# EAGLE schematic WS2812-Ring_v10 (EAGLE 6.6.0)
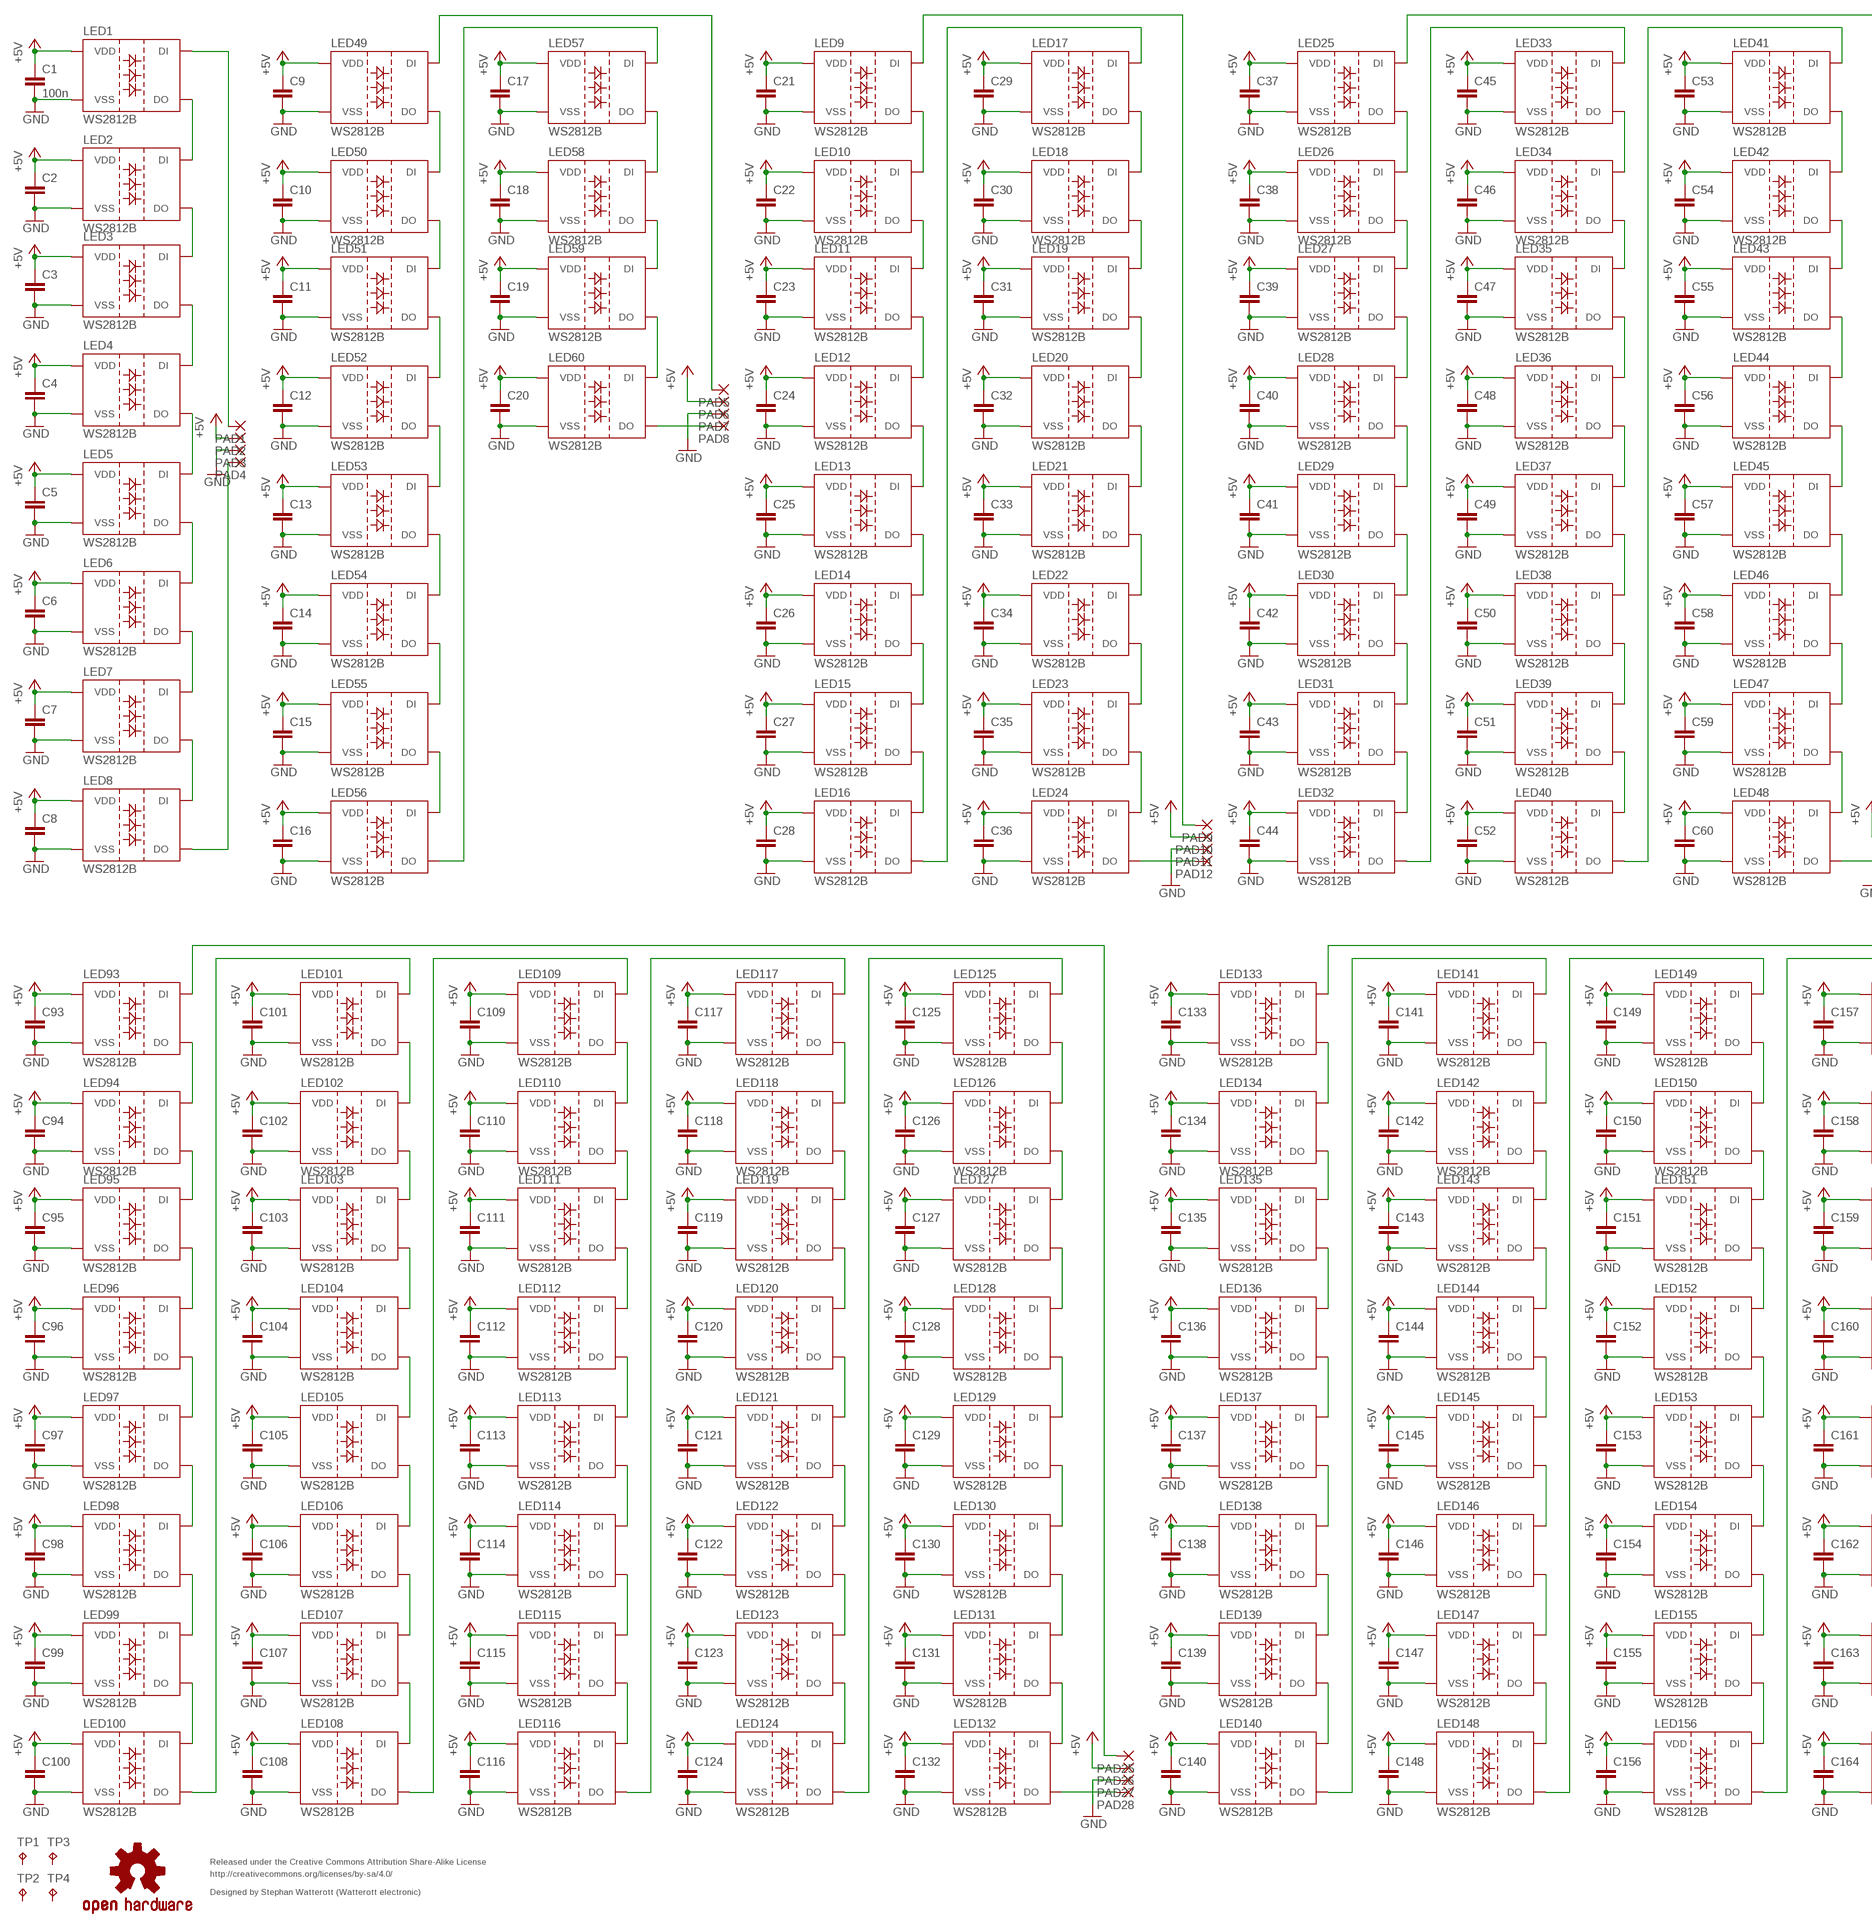
[diagram p0: schematic, sheet 1, part 1 of 2]
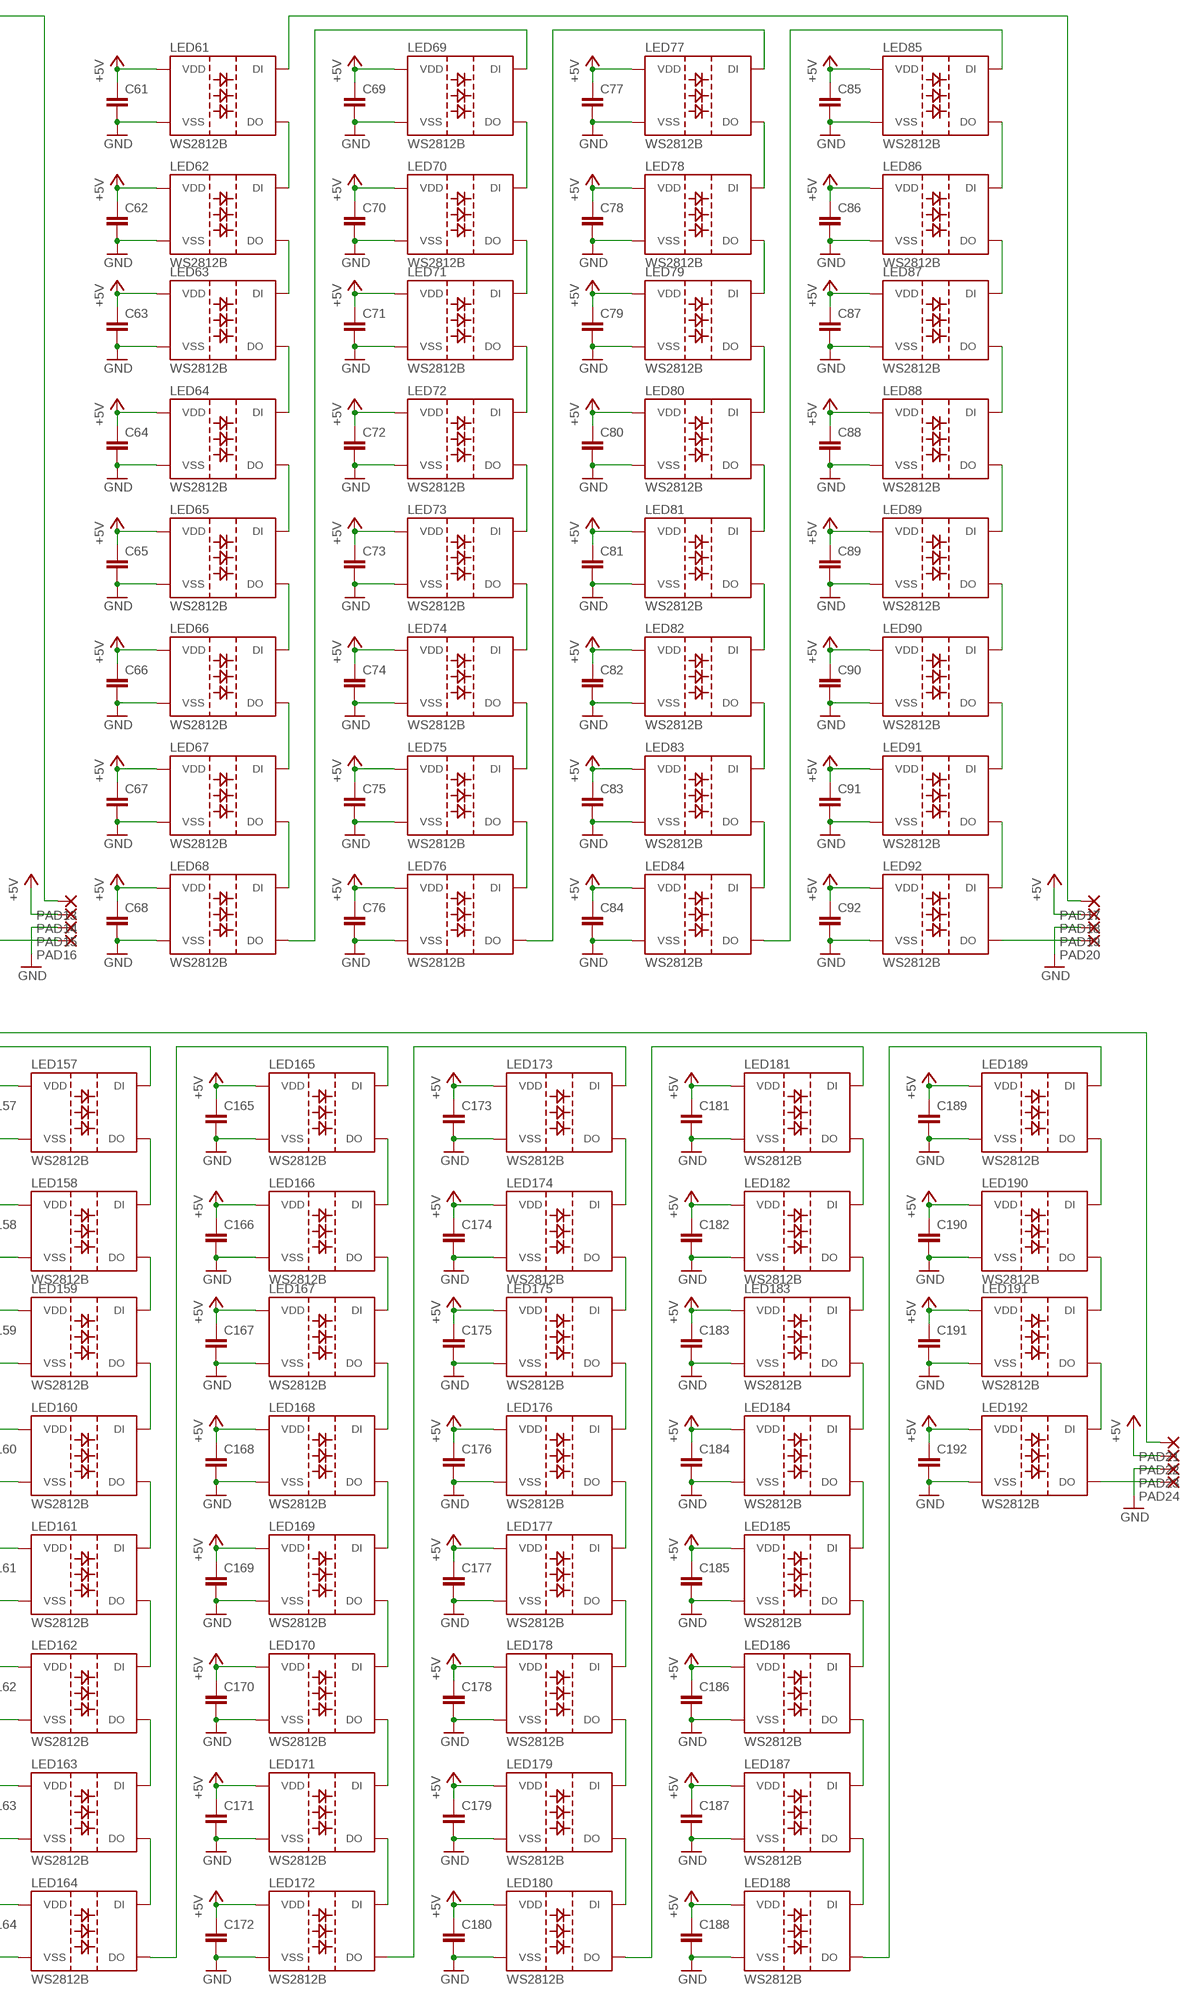
[diagram p1: schematic, sheet 1, part 2 of 2]

## Parts
C1  100n  C-EUC0402K  [C0402K]
C2  C-EUC0402K  [C0402K]
C3  C-EUC0402K  [C0402K]
C4  C-EUC0402K  [C0402K]
C5  C-EUC0402K  [C0402K]
C6  C-EUC0402K  [C0402K]
C7  C-EUC0402K  [C0402K]
C8  C-EUC0402K  [C0402K]
C9  C-EUC0402K  [C0402K]
C10  C-EUC0402K  [C0402K]
C11  C-EUC0402K  [C0402K]
C12  C-EUC0402K  [C0402K]
C13  C-EUC0402K  [C0402K]
C14  C-EUC0402K  [C0402K]
C15  C-EUC0402K  [C0402K]
C16  C-EUC0402K  [C0402K]
C17  C-EUC0402K  [C0402K]
C18  C-EUC0402K  [C0402K]
C19  C-EUC0402K  [C0402K]
C20  C-EUC0402K  [C0402K]
C21  C-EUC0402K  [C0402K]
C22  C-EUC0402K  [C0402K]
C23  C-EUC0402K  [C0402K]
C24  C-EUC0402K  [C0402K]
C25  C-EUC0402K  [C0402K]
C26  C-EUC0402K  [C0402K]
C27  C-EUC0402K  [C0402K]
C28  C-EUC0402K  [C0402K]
C29  C-EUC0402K  [C0402K]
C30  C-EUC0402K  [C0402K]
C31  C-EUC0402K  [C0402K]
C32  C-EUC0402K  [C0402K]
C33  C-EUC0402K  [C0402K]
C34  C-EUC0402K  [C0402K]
C35  C-EUC0402K  [C0402K]
C36  C-EUC0402K  [C0402K]
C37  C-EUC0402K  [C0402K]
C38  C-EUC0402K  [C0402K]
C39  C-EUC0402K  [C0402K]
C40  C-EUC0402K  [C0402K]
C41  C-EUC0402K  [C0402K]
C42  C-EUC0402K  [C0402K]
C43  C-EUC0402K  [C0402K]
C44  C-EUC0402K  [C0402K]
C45  C-EUC0402K  [C0402K]
C46  C-EUC0402K  [C0402K]
C47  C-EUC0402K  [C0402K]
C48  C-EUC0402K  [C0402K]
C49  C-EUC0402K  [C0402K]
C50  C-EUC0402K  [C0402K]
C51  C-EUC0402K  [C0402K]
C52  C-EUC0402K  [C0402K]
C53  C-EUC0402K  [C0402K]
C54  C-EUC0402K  [C0402K]
C55  C-EUC0402K  [C0402K]
C56  C-EUC0402K  [C0402K]
C57  C-EUC0402K  [C0402K]
C58  C-EUC0402K  [C0402K]
C59  C-EUC0402K  [C0402K]
C60  C-EUC0402K  [C0402K]
C61  C-EUC0402K  [C0402K]
C62  C-EUC0402K  [C0402K]
C63  C-EUC0402K  [C0402K]
C64  C-EUC0402K  [C0402K]
C65  C-EUC0402K  [C0402K]
C66  C-EUC0402K  [C0402K]
C67  C-EUC0402K  [C0402K]
C68  C-EUC0402K  [C0402K]
C69  C-EUC0402K  [C0402K]
C70  C-EUC0402K  [C0402K]
C71  C-EUC0402K  [C0402K]
C72  C-EUC0402K  [C0402K]
C73  C-EUC0402K  [C0402K]
C74  C-EUC0402K  [C0402K]
C75  C-EUC0402K  [C0402K]
C76  C-EUC0402K  [C0402K]
C77  C-EUC0402K  [C0402K]
C78  C-EUC0402K  [C0402K]
C79  C-EUC0402K  [C0402K]
C80  C-EUC0402K  [C0402K]
C81  C-EUC0402K  [C0402K]
C82  C-EUC0402K  [C0402K]
C83  C-EUC0402K  [C0402K]
C84  C-EUC0402K  [C0402K]
C85  C-EUC0402K  [C0402K]
C86  C-EUC0402K  [C0402K]
C87  C-EUC0402K  [C0402K]
C88  C-EUC0402K  [C0402K]
C89  C-EUC0402K  [C0402K]
C90  C-EUC0402K  [C0402K]
C91  C-EUC0402K  [C0402K]
C92  C-EUC0402K  [C0402K]
C93  C-EUC0402K  [C0402K]
C94  C-EUC0402K  [C0402K]
C95  C-EUC0402K  [C0402K]
C96  C-EUC0402K  [C0402K]
C97  C-EUC0402K  [C0402K]
C98  C-EUC0402K  [C0402K]
C99  C-EUC0402K  [C0402K]
C100  C-EUC0402K  [C0402K]
C101  C-EUC0402K  [C0402K]
C102  C-EUC0402K  [C0402K]
C103  C-EUC0402K  [C0402K]
C104  C-EUC0402K  [C0402K]
C105  C-EUC0402K  [C0402K]
C106  C-EUC0402K  [C0402K]
C107  C-EUC0402K  [C0402K]
C108  C-EUC0402K  [C0402K]
C109  C-EUC0402K  [C0402K]
C110  C-EUC0402K  [C0402K]
C111  C-EUC0402K  [C0402K]
C112  C-EUC0402K  [C0402K]
C113  C-EUC0402K  [C0402K]
C114  C-EUC0402K  [C0402K]
C115  C-EUC0402K  [C0402K]
C116  C-EUC0402K  [C0402K]
C117  C-EUC0402K  [C0402K]
C118  C-EUC0402K  [C0402K]
C119  C-EUC0402K  [C0402K]
C120  C-EUC0402K  [C0402K]
C121  C-EUC0402K  [C0402K]
C122  C-EUC0402K  [C0402K]
C123  C-EUC0402K  [C0402K]
C124  C-EUC0402K  [C0402K]
C125  C-EUC0402K  [C0402K]
C126  C-EUC0402K  [C0402K]
C127  C-EUC0402K  [C0402K]
C128  C-EUC0402K  [C0402K]
C129  C-EUC0402K  [C0402K]
C130  C-EUC0402K  [C0402K]
C131  C-EUC0402K  [C0402K]
C132  C-EUC0402K  [C0402K]
C133  C-EUC0402K  [C0402K]
C134  C-EUC0402K  [C0402K]
C135  C-EUC0402K  [C0402K]
C136  C-EUC0402K  [C0402K]
C137  C-EUC0402K  [C0402K]
C138  C-EUC0402K  [C0402K]
C139  C-EUC0402K  [C0402K]
C140  C-EUC0402K  [C0402K]
C141  C-EUC0402K  [C0402K]
C142  C-EUC0402K  [C0402K]
C143  C-EUC0402K  [C0402K]
C144  C-EUC0402K  [C0402K]
C145  C-EUC0402K  [C0402K]
C146  C-EUC0402K  [C0402K]
C147  C-EUC0402K  [C0402K]
C148  C-EUC0402K  [C0402K]
C149  C-EUC0402K  [C0402K]
C150  C-EUC0402K  [C0402K]
C151  C-EUC0402K  [C0402K]
C152  C-EUC0402K  [C0402K]
C153  C-EUC0402K  [C0402K]
C154  C-EUC0402K  [C0402K]
C155  C-EUC0402K  [C0402K]
C156  C-EUC0402K  [C0402K]
C157  C-EUC0402K  [C0402K]
C158  C-EUC0402K  [C0402K]
C159  C-EUC0402K  [C0402K]
C160  C-EUC0402K  [C0402K]
C161  C-EUC0402K  [C0402K]
C162  C-EUC0402K  [C0402K]
C163  C-EUC0402K  [C0402K]
C164  C-EUC0402K  [C0402K]
C165  C-EUC0402K  [C0402K]
C166  C-EUC0402K  [C0402K]
C167  C-EUC0402K  [C0402K]
C168  C-EUC0402K  [C0402K]
C169  C-EUC0402K  [C0402K]
C170  C-EUC0402K  [C0402K]
C171  C-EUC0402K  [C0402K]
C172  C-EUC0402K  [C0402K]
C173  C-EUC0402K  [C0402K]
C174  C-EUC0402K  [C0402K]
C175  C-EUC0402K  [C0402K]
C176  C-EUC0402K  [C0402K]
C177  C-EUC0402K  [C0402K]
C178  C-EUC0402K  [C0402K]
C179  C-EUC0402K  [C0402K]
C180  C-EUC0402K  [C0402K]
C181  C-EUC0402K  [C0402K]
C182  C-EUC0402K  [C0402K]
C183  C-EUC0402K  [C0402K]
C184  C-EUC0402K  [C0402K]
C185  C-EUC0402K  [C0402K]
C186  C-EUC0402K  [C0402K]
C187  C-EUC0402K  [C0402K]
C188  C-EUC0402K  [C0402K]
C189  C-EUC0402K  [C0402K]
C190  C-EUC0402K  [C0402K]
C191  C-EUC0402K  [C0402K]
C192  C-EUC0402K  [C0402K]
LED1  WS2812B  [WS2812B]
LED2  WS2812B  [WS2812B]
LED3  WS2812B  [WS2812B]
LED4  WS2812B  [WS2812B]
LED5  WS2812B  [WS2812B]
LED6  WS2812B  [WS2812B]
LED7  WS2812B  [WS2812B]
LED8  WS2812B  [WS2812B]
LED9  WS2812B  [WS2812B]
LED10  WS2812B  [WS2812B]
LED11  WS2812B  [WS2812B]
LED12  WS2812B  [WS2812B]
LED13  WS2812B  [WS2812B]
LED14  WS2812B  [WS2812B]
LED15  WS2812B  [WS2812B]
LED16  WS2812B  [WS2812B]
LED17  WS2812B  [WS2812B]
LED18  WS2812B  [WS2812B]
LED19  WS2812B  [WS2812B]
LED20  WS2812B  [WS2812B]
LED21  WS2812B  [WS2812B]
LED22  WS2812B  [WS2812B]
LED23  WS2812B  [WS2812B]
LED24  WS2812B  [WS2812B]
LED25  WS2812B  [WS2812B]
LED26  WS2812B  [WS2812B]
LED27  WS2812B  [WS2812B]
LED28  WS2812B  [WS2812B]
LED29  WS2812B  [WS2812B]
LED30  WS2812B  [WS2812B]
LED31  WS2812B  [WS2812B]
LED32  WS2812B  [WS2812B]
LED33  WS2812B  [WS2812B]
LED34  WS2812B  [WS2812B]
LED35  WS2812B  [WS2812B]
LED36  WS2812B  [WS2812B]
LED37  WS2812B  [WS2812B]
LED38  WS2812B  [WS2812B]
LED39  WS2812B  [WS2812B]
LED40  WS2812B  [WS2812B]
LED41  WS2812B  [WS2812B]
LED42  WS2812B  [WS2812B]
LED43  WS2812B  [WS2812B]
LED44  WS2812B  [WS2812B]
LED45  WS2812B  [WS2812B]
LED46  WS2812B  [WS2812B]
LED47  WS2812B  [WS2812B]
LED48  WS2812B  [WS2812B]
LED49  WS2812B  [WS2812B]
LED50  WS2812B  [WS2812B]
LED51  WS2812B  [WS2812B]
LED52  WS2812B  [WS2812B]
LED53  WS2812B  [WS2812B]
LED54  WS2812B  [WS2812B]
LED55  WS2812B  [WS2812B]
LED56  WS2812B  [WS2812B]
LED57  WS2812B  [WS2812B]
LED58  WS2812B  [WS2812B]
LED59  WS2812B  [WS2812B]
LED60  WS2812B  [WS2812B]
LED61  WS2812B  [WS2812B]
LED62  WS2812B  [WS2812B]
LED63  WS2812B  [WS2812B]
LED64  WS2812B  [WS2812B]
LED65  WS2812B  [WS2812B]
LED66  WS2812B  [WS2812B]
LED67  WS2812B  [WS2812B]
LED68  WS2812B  [WS2812B]
LED69  WS2812B  [WS2812B]
LED70  WS2812B  [WS2812B]
LED71  WS2812B  [WS2812B]
LED72  WS2812B  [WS2812B]
LED73  WS2812B  [WS2812B]
LED74  WS2812B  [WS2812B]
LED75  WS2812B  [WS2812B]
LED76  WS2812B  [WS2812B]
LED77  WS2812B  [WS2812B]
LED78  WS2812B  [WS2812B]
LED79  WS2812B  [WS2812B]
LED80  WS2812B  [WS2812B]
LED81  WS2812B  [WS2812B]
LED82  WS2812B  [WS2812B]
LED83  WS2812B  [WS2812B]
LED84  WS2812B  [WS2812B]
LED85  WS2812B  [WS2812B]
LED86  WS2812B  [WS2812B]
LED87  WS2812B  [WS2812B]
LED88  WS2812B  [WS2812B]
LED89  WS2812B  [WS2812B]
LED90  WS2812B  [WS2812B]
LED91  WS2812B  [WS2812B]
LED92  WS2812B  [WS2812B]
LED93  WS2812B  [WS2812B]
LED94  WS2812B  [WS2812B]
LED95  WS2812B  [WS2812B]
LED96  WS2812B  [WS2812B]
LED97  WS2812B  [WS2812B]
LED98  WS2812B  [WS2812B]
LED99  WS2812B  [WS2812B]
LED100  WS2812B  [WS2812B]
LED101  WS2812B  [WS2812B]
LED102  WS2812B  [WS2812B]
LED103  WS2812B  [WS2812B]
LED104  WS2812B  [WS2812B]
LED105  WS2812B  [WS2812B]
LED106  WS2812B  [WS2812B]
LED107  WS2812B  [WS2812B]
LED108  WS2812B  [WS2812B]
LED109  WS2812B  [WS2812B]
LED110  WS2812B  [WS2812B]
LED111  WS2812B  [WS2812B]
LED112  WS2812B  [WS2812B]
LED113  WS2812B  [WS2812B]
LED114  WS2812B  [WS2812B]
LED115  WS2812B  [WS2812B]
LED116  WS2812B  [WS2812B]
LED117  WS2812B  [WS2812B]
LED118  WS2812B  [WS2812B]
LED119  WS2812B  [WS2812B]
LED120  WS2812B  [WS2812B]
LED121  WS2812B  [WS2812B]
LED122  WS2812B  [WS2812B]
LED123  WS2812B  [WS2812B]
LED124  WS2812B  [WS2812B]
LED125  WS2812B  [WS2812B]
LED126  WS2812B  [WS2812B]
LED127  WS2812B  [WS2812B]
LED128  WS2812B  [WS2812B]
LED129  WS2812B  [WS2812B]
LED130  WS2812B  [WS2812B]
LED131  WS2812B  [WS2812B]
LED132  WS2812B  [WS2812B]
LED133  WS2812B  [WS2812B]
LED134  WS2812B  [WS2812B]
LED135  WS2812B  [WS2812B]
LED136  WS2812B  [WS2812B]
LED137  WS2812B  [WS2812B]
LED138  WS2812B  [WS2812B]
LED139  WS2812B  [WS2812B]
LED140  WS2812B  [WS2812B]
LED141  WS2812B  [WS2812B]
LED142  WS2812B  [WS2812B]
LED143  WS2812B  [WS2812B]
LED144  WS2812B  [WS2812B]
LED145  WS2812B  [WS2812B]
LED146  WS2812B  [WS2812B]
LED147  WS2812B  [WS2812B]
LED148  WS2812B  [WS2812B]
LED149  WS2812B  [WS2812B]
LED150  WS2812B  [WS2812B]
LED151  WS2812B  [WS2812B]
LED152  WS2812B  [WS2812B]
LED153  WS2812B  [WS2812B]
LED154  WS2812B  [WS2812B]
LED155  WS2812B  [WS2812B]
LED156  WS2812B  [WS2812B]
LED157  WS2812B  [WS2812B]
LED158  WS2812B  [WS2812B]
LED159  WS2812B  [WS2812B]
LED160  WS2812B  [WS2812B]
LED161  WS2812B  [WS2812B]
LED162  WS2812B  [WS2812B]
LED163  WS2812B  [WS2812B]
LED164  WS2812B  [WS2812B]
LED165  WS2812B  [WS2812B]
LED166  WS2812B  [WS2812B]
LED167  WS2812B  [WS2812B]
LED168  WS2812B  [WS2812B]
LED169  WS2812B  [WS2812B]
LED170  WS2812B  [WS2812B]
LED171  WS2812B  [WS2812B]
LED172  WS2812B  [WS2812B]
LED173  WS2812B  [WS2812B]
LED174  WS2812B  [WS2812B]
LED175  WS2812B  [WS2812B]
LED176  WS2812B  [WS2812B]
LED177  WS2812B  [WS2812B]
LED178  WS2812B  [WS2812B]
LED179  WS2812B  [WS2812B]
LED180  WS2812B  [WS2812B]
LED181  WS2812B  [WS2812B]
LED182  WS2812B  [WS2812B]
LED183  WS2812B  [WS2812B]
LED184  WS2812B  [WS2812B]
LED185  WS2812B  [WS2812B]
LED186  WS2812B  [WS2812B]
LED187  WS2812B  [WS2812B]
LED188  WS2812B  [WS2812B]
LED189  WS2812B  [WS2812B]
LED190  WS2812B  [WS2812B]
LED191  WS2812B  [WS2812B]
LED192  WS2812B  [WS2812B]
LOGO7  OSHW-LOGOM  [OSHW-LOGO-M]
PAD1  SMD2  [SMD1,27-2,54]
PAD2  SMD2  [SMD1,27-2,54]
PAD3  SMD2  [SMD1,27-2,54]
PAD4  SMD2  [SMD1,27-2,54]
PAD5  SMD2  [SMD1,27-2,54]
PAD6  SMD2  [SMD1,27-2,54]
PAD7  SMD2  [SMD1,27-2,54]
PAD8  SMD2  [SMD1,27-2,54]
PAD9  SMD2  [SMD1,27-2,54]
PAD10  SMD2  [SMD1,27-2,54]
PAD11  SMD2  [SMD1,27-2,54]
PAD12  SMD2  [SMD1,27-2,54]
PAD13  SMD2  [SMD1,27-2,54]
PAD14  SMD2  [SMD1,27-2,54]
PAD15  SMD2  [SMD1,27-2,54]
PAD16  SMD2  [SMD1,27-2,54]
PAD17  SMD2  [SMD1,27-2,54]
PAD18  SMD2  [SMD1,27-2,54]
PAD19  SMD2  [SMD1,27-2,54]
PAD20  SMD2  [SMD1,27-2,54]
PAD21  SMD2  [SMD1,27-2,54]
PAD22  SMD2  [SMD1,27-2,54]
PAD23  SMD2  [SMD1,27-2,54]
PAD24  SMD2  [SMD1,27-2,54]
PAD25  SMD2  [SMD1,27-2,54]
PAD26  SMD2  [SMD1,27-2,54]
PAD27  SMD2  [SMD1,27-2,54]
PAD28  SMD2  [SMD1,27-2,54]
TP1  TPB1,27  [B1,27]
TP2  TPB1,27  [B1,27]
TP3  TPB1,27  [B1,27]
TP4  TPB1,27  [B1,27]

## Nets
+5V: C1.1 C2.1 C3.1 C4.1 C5.1 C6.1 C7.1 C8.1 C9.1 C10.1 C11.1 C12.1 C13.1 C14.1 C15.1 C16.1 C17.1 C18.1 C19.1 C20.1 C21.1 C22.1 C23.1 C24.1 C25.1 C26.1 C27.1 C28.1 C29.1 C30.1 C31.1 C32.1 C33.1 C34.1 C35.1 C36.1 C37.1 C38.1 C39.1 C40.1 C41.1 C42.1 C43.1 C44.1 C45.1 C46.1 C47.1 C48.1 C49.1 C50.1 C51.1 C52.1 C53.1 C54.1 C55.1 C56.1 C57.1 C58.1 C59.1 C60.1 C61.1 C62.1 C63.1 C64.1 C65.1 C66.1 C67.1 C68.1 C69.1 C70.1 C71.1 C72.1 C73.1 C74.1 C75.1 C76.1 C77.1 C78.1 C79.1 C80.1 C81.1 C82.1 C83.1 C84.1 C85.1 C86.1 C87.1 C88.1 C89.1 C90.1 C91.1 C92.1 C93.1 C94.1 C95.1 C96.1 C97.1 C98.1 C99.1 C100.1 C101.1 C102.1 C103.1 C104.1 C105.1 C106.1 C107.1 C108.1 C109.1 C110.1 C111.1 C112.1 C113.1 C114.1 C115.1 C116.1 C117.1 C118.1 C119.1 C120.1 C121.1 C122.1 C123.1 C124.1 C125.1 C126.1 C127.1 C128.1 C129.1 C130.1 C131.1 C132.1 C133.1 C134.1 C135.1 C136.1 C137.1 C138.1 C139.1 C140.1 C141.1 C142.1 C143.1 C144.1 C145.1 C146.1 C147.1 C148.1 C149.1 C150.1 C151.1 C152.1 C153.1 C154.1 C155.1 C156.1 C157.1 C158.1 C159.1 C160.1 C161.1 C162.1 C163.1 C164.1 C165.1 C166.1 C167.1 C168.1 C169.1 C170.1 C171.1 C172.1 C173.1 C174.1 C175.1 C176.1 C177.1 C178.1 C179.1 C180.1 C181.1 C182.1 C183.1 C184.1 C185.1 C186.1 C187.1 C188.1 C189.1 C190.1 C191.1 C192.1 LED1.1(VDD) LED2.1(VDD) LED3.1(VDD) LED4.1(VDD) LED5.1(VDD) LED6.1(VDD) LED7.1(VDD) LED8.1(VDD) LED9.1(VDD) LED10.1(VDD) LED11.1(VDD) LED12.1(VDD) LED13.1(VDD) LED14.1(VDD) LED15.1(VDD) LED16.1(VDD) LED17.1(VDD) LED18.1(VDD) LED19.1(VDD) LED20.1(VDD) LED21.1(VDD) LED22.1(VDD) LED23.1(VDD) LED24.1(VDD) LED25.1(VDD) LED26.1(VDD) LED27.1(VDD) LED28.1(VDD) LED29.1(VDD) LED30.1(VDD) LED31.1(VDD) LED32.1(VDD) LED33.1(VDD) LED34.1(VDD) LED35.1(VDD) LED36.1(VDD) LED37.1(VDD) LED38.1(VDD) LED39.1(VDD) LED40.1(VDD) LED41.1(VDD) LED42.1(VDD) LED43.1(VDD) LED44.1(VDD) LED45.1(VDD) LED46.1(VDD) LED47.1(VDD) LED48.1(VDD) LED49.1(VDD) LED50.1(VDD) LED51.1(VDD) LED52.1(VDD) LED53.1(VDD) LED54.1(VDD) LED55.1(VDD) LED56.1(VDD) LED57.1(VDD) LED58.1(VDD) LED59.1(VDD) LED60.1(VDD) LED61.1(VDD) LED62.1(VDD) LED63.1(VDD) LED64.1(VDD) LED65.1(VDD) LED66.1(VDD) LED67.1(VDD) LED68.1(VDD) LED69.1(VDD) LED70.1(VDD) LED71.1(VDD) LED72.1(VDD) LED73.1(VDD) LED74.1(VDD) LED75.1(VDD) LED76.1(VDD) LED77.1(VDD) LED78.1(VDD) LED79.1(VDD) LED80.1(VDD) LED81.1(VDD) LED82.1(VDD) LED83.1(VDD) LED84.1(VDD) LED85.1(VDD) LED86.1(VDD) LED87.1(VDD) LED88.1(VDD) LED89.1(VDD) LED90.1(VDD) LED91.1(VDD) LED92.1(VDD) LED93.1(VDD) LED94.1(VDD) LED95.1(VDD) LED96.1(VDD) LED97.1(VDD) LED98.1(VDD) LED99.1(VDD) LED100.1(VDD) LED101.1(VDD) LED102.1(VDD) LED103.1(VDD) LED104.1(VDD) LED105.1(VDD) LED106.1(VDD) LED107.1(VDD) LED108.1(VDD) LED109.1(VDD) LED110.1(VDD) LED111.1(VDD) LED112.1(VDD) LED113.1(VDD) LED114.1(VDD) LED115.1(VDD) LED116.1(VDD) LED117.1(VDD) LED118.1(VDD) LED119.1(VDD) LED120.1(VDD) LED121.1(VDD) LED122.1(VDD) LED123.1(VDD) LED124.1(VDD) LED125.1(VDD) LED126.1(VDD) LED127.1(VDD) LED128.1(VDD) LED129.1(VDD) LED130.1(VDD) LED131.1(VDD) LED132.1(VDD) LED133.1(VDD) LED134.1(VDD) LED135.1(VDD) LED136.1(VDD) LED137.1(VDD) LED138.1(VDD) LED139.1(VDD) LED140.1(VDD) LED141.1(VDD) LED142.1(VDD) LED143.1(VDD) LED144.1(VDD) LED145.1(VDD) LED146.1(VDD) LED147.1(VDD) LED148.1(VDD) LED149.1(VDD) LED150.1(VDD) LED151.1(VDD) LED152.1(VDD) LED153.1(VDD) LED154.1(VDD) LED155.1(VDD) LED156.1(VDD) LED157.1(VDD) LED158.1(VDD) LED159.1(VDD) LED160.1(VDD) LED161.1(VDD) LED162.1(VDD) LED163.1(VDD) LED164.1(VDD) LED165.1(VDD) LED166.1(VDD) LED167.1(VDD) LED168.1(VDD) LED169.1(VDD) LED170.1(VDD) LED171.1(VDD) LED172.1(VDD) LED173.1(VDD) LED174.1(VDD) LED175.1(VDD) LED176.1(VDD) LED177.1(VDD) LED178.1(VDD) LED179.1(VDD) LED180.1(VDD) LED181.1(VDD) LED182.1(VDD) LED183.1(VDD) LED184.1(VDD) LED185.1(VDD) LED186.1(VDD) LED187.1(VDD) LED188.1(VDD) LED189.1(VDD) LED190.1(VDD) LED191.1(VDD) LED192.1(VDD) PAD2.1(P) PAD6.1(P) PAD10.1(P) PAD14.1(P) PAD18.1(P) PAD22.1(P) PAD26.1(P)
GND: C1.2 C2.2 C3.2 C4.2 C5.2 C6.2 C7.2 C8.2 C9.2 C10.2 C11.2 C12.2 C13.2 C14.2 C15.2 C16.2 C17.2 C18.2 C19.2 C20.2 C21.2 C22.2 C23.2 C24.2 C25.2 C26.2 C27.2 C28.2 C29.2 C30.2 C31.2 C32.2 C33.2 C34.2 C35.2 C36.2 C37.2 C38.2 C39.2 C40.2 C41.2 C42.2 C43.2 C44.2 C45.2 C46.2 C47.2 C48.2 C49.2 C50.2 C51.2 C52.2 C53.2 C54.2 C55.2 C56.2 C57.2 C58.2 C59.2 C60.2 C61.2 C62.2 C63.2 C64.2 C65.2 C66.2 C67.2 C68.2 C69.2 C70.2 C71.2 C72.2 C73.2 C74.2 C75.2 C76.2 C77.2 C78.2 C79.2 C80.2 C81.2 C82.2 C83.2 C84.2 C85.2 C86.2 C87.2 C88.2 C89.2 C90.2 C91.2 C92.2 C93.2 C94.2 C95.2 C96.2 C97.2 C98.2 C99.2 C100.2 C101.2 C102.2 C103.2 C104.2 C105.2 C106.2 C107.2 C108.2 C109.2 C110.2 C111.2 C112.2 C113.2 C114.2 C115.2 C116.2 C117.2 C118.2 C119.2 C120.2 C121.2 C122.2 C123.2 C124.2 C125.2 C126.2 C127.2 C128.2 C129.2 C130.2 C131.2 C132.2 C133.2 C134.2 C135.2 C136.2 C137.2 C138.2 C139.2 C140.2 C141.2 C142.2 C143.2 C144.2 C145.2 C146.2 C147.2 C148.2 C149.2 C150.2 C151.2 C152.2 C153.2 C154.2 C155.2 C156.2 C157.2 C158.2 C159.2 C160.2 C161.2 C162.2 C163.2 C164.2 C165.2 C166.2 C167.2 C168.2 C169.2 C170.2 C171.2 C172.2 C173.2 C174.2 C175.2 C176.2 C177.2 C178.2 C179.2 C180.2 C181.2 C182.2 C183.2 C184.2 C185.2 C186.2 C187.2 C188.2 C189.2 C190.2 C191.2 C192.2 LED1.3(VSS) LED2.3(VSS) LED3.3(VSS) LED4.3(VSS) LED5.3(VSS) LED6.3(VSS) LED7.3(VSS) LED8.3(VSS) LED9.3(VSS) LED10.3(VSS) LED11.3(VSS) LED12.3(VSS) LED13.3(VSS) LED14.3(VSS) LED15.3(VSS) LED16.3(VSS) LED17.3(VSS) LED18.3(VSS) LED19.3(VSS) LED20.3(VSS) LED21.3(VSS) LED22.3(VSS) LED23.3(VSS) LED24.3(VSS) LED25.3(VSS) LED26.3(VSS) LED27.3(VSS) LED28.3(VSS) LED29.3(VSS) LED30.3(VSS) LED31.3(VSS) LED32.3(VSS) LED33.3(VSS) LED34.3(VSS) LED35.3(VSS) LED36.3(VSS) LED37.3(VSS) LED38.3(VSS) LED39.3(VSS) LED40.3(VSS) LED41.3(VSS) LED42.3(VSS) LED43.3(VSS) LED44.3(VSS) LED45.3(VSS) LED46.3(VSS) LED47.3(VSS) LED48.3(VSS) LED49.3(VSS) LED50.3(VSS) LED51.3(VSS) LED52.3(VSS) LED53.3(VSS) LED54.3(VSS) LED55.3(VSS) LED56.3(VSS) LED57.3(VSS) LED58.3(VSS) LED59.3(VSS) LED60.3(VSS) LED61.3(VSS) LED62.3(VSS) LED63.3(VSS) LED64.3(VSS) LED65.3(VSS) LED66.3(VSS) LED67.3(VSS) LED68.3(VSS) LED69.3(VSS) LED70.3(VSS) LED71.3(VSS) LED72.3(VSS) LED73.3(VSS) LED74.3(VSS) LED75.3(VSS) LED76.3(VSS) LED77.3(VSS) LED78.3(VSS) LED79.3(VSS) LED80.3(VSS) LED81.3(VSS) LED82.3(VSS) LED83.3(VSS) LED84.3(VSS) LED85.3(VSS) LED86.3(VSS) LED87.3(VSS) LED88.3(VSS) LED89.3(VSS) LED90.3(VSS) LED91.3(VSS) LED92.3(VSS) LED93.3(VSS) LED94.3(VSS) LED95.3(VSS) LED96.3(VSS) LED97.3(VSS) LED98.3(VSS) LED99.3(VSS) LED100.3(VSS) LED101.3(VSS) LED102.3(VSS) LED103.3(VSS) LED104.3(VSS) LED105.3(VSS) LED106.3(VSS) LED107.3(VSS) LED108.3(VSS) LED109.3(VSS) LED110.3(VSS) LED111.3(VSS) LED112.3(VSS) LED113.3(VSS) LED114.3(VSS) LED115.3(VSS) LED116.3(VSS) LED117.3(VSS) LED118.3(VSS) LED119.3(VSS) LED120.3(VSS) LED121.3(VSS) LED122.3(VSS) LED123.3(VSS) LED124.3(VSS) LED125.3(VSS) LED126.3(VSS) LED127.3(VSS) LED128.3(VSS) LED129.3(VSS) LED130.3(VSS) LED131.3(VSS) LED132.3(VSS) LED133.3(VSS) LED134.3(VSS) LED135.3(VSS) LED136.3(VSS) LED137.3(VSS) LED138.3(VSS) LED139.3(VSS) LED140.3(VSS) LED141.3(VSS) LED142.3(VSS) LED143.3(VSS) LED144.3(VSS) LED145.3(VSS) LED146.3(VSS) LED147.3(VSS) LED148.3(VSS) LED149.3(VSS) LED150.3(VSS) LED151.3(VSS) LED152.3(VSS) LED153.3(VSS) LED154.3(VSS) LED155.3(VSS) LED156.3(VSS) LED157.3(VSS) LED158.3(VSS) LED159.3(VSS) LED160.3(VSS) LED161.3(VSS) LED162.3(VSS) LED163.3(VSS) LED164.3(VSS) LED165.3(VSS) LED166.3(VSS) LED167.3(VSS) LED168.3(VSS) LED169.3(VSS) LED170.3(VSS) LED171.3(VSS) LED172.3(VSS) LED173.3(VSS) LED174.3(VSS) LED175.3(VSS) LED176.3(VSS) LED177.3(VSS) LED178.3(VSS) LED179.3(VSS) LED180.3(VSS) LED181.3(VSS) LED182.3(VSS) LED183.3(VSS) LED184.3(VSS) LED185.3(VSS) LED186.3(VSS) LED187.3(VSS) LED188.3(VSS) LED189.3(VSS) LED190.3(VSS) LED191.3(VSS) LED192.3(VSS) PAD3.1(P) PAD7.1(P) PAD11.1(P) PAD15.1(P) PAD19.1(P) PAD23.1(P) PAD27.1(P)
N$1: LED1.2(DO) LED2.4(DI)
N$2: LED2.2(DO) LED3.4(DI)
N$3: LED3.2(DO) LED4.4(DI)
N$4: LED4.2(DO) LED5.4(DI)
N$5: LED5.2(DO) LED6.4(DI)
N$6: LED6.2(DO) LED7.4(DI)
N$7: LED7.2(DO) LED8.4(DI)
N$8: LED9.2(DO) LED10.4(DI)
N$9: LED10.2(DO) LED11.4(DI)
N$10: LED11.2(DO) LED12.4(DI)
N$11: LED12.2(DO) LED13.4(DI)
N$12: LED13.2(DO) LED14.4(DI)
N$13: LED14.2(DO) LED15.4(DI)
N$14: LED15.2(DO) LED16.4(DI)
N$15: LED17.2(DO) LED18.4(DI)
N$16: LED18.2(DO) LED19.4(DI)
N$17: LED19.2(DO) LED20.4(DI)
N$18: LED20.2(DO) LED21.4(DI)
N$19: LED21.2(DO) LED22.4(DI)
N$20: LED22.2(DO) LED23.4(DI)
N$21: LED23.2(DO) LED24.4(DI)
N$22: LED16.2(DO) LED17.4(DI)
N$23: LED25.2(DO) LED26.4(DI)
N$24: LED26.2(DO) LED27.4(DI)
N$25: LED27.2(DO) LED28.4(DI)
N$26: LED28.2(DO) LED29.4(DI)
N$27: LED29.2(DO) LED30.4(DI)
N$28: LED30.2(DO) LED31.4(DI)
N$29: LED31.2(DO) LED32.4(DI)
N$30: LED33.2(DO) LED34.4(DI)
N$31: LED34.2(DO) LED35.4(DI)
N$32: LED35.2(DO) LED36.4(DI)
N$33: LED36.2(DO) LED37.4(DI)
N$34: LED37.2(DO) LED38.4(DI)
N$35: LED38.2(DO) LED39.4(DI)
N$36: LED39.2(DO) LED40.4(DI)
N$37: LED32.2(DO) LED33.4(DI)
N$38: LED41.2(DO) LED42.4(DI)
N$39: LED42.2(DO) LED43.4(DI)
N$40: LED43.2(DO) LED44.4(DI)
N$41: LED44.2(DO) LED45.4(DI)
N$42: LED45.2(DO) LED46.4(DI)
N$43: LED46.2(DO) LED47.4(DI)
N$44: LED47.2(DO) LED48.4(DI)
N$45: LED40.2(DO) LED41.4(DI)
N$46: LED49.2(DO) LED50.4(DI)
N$47: LED50.2(DO) LED51.4(DI)
N$48: LED51.2(DO) LED52.4(DI)
N$49: LED52.2(DO) LED53.4(DI)
N$50: LED53.2(DO) LED54.4(DI)
N$51: LED54.2(DO) LED55.4(DI)
N$52: LED55.2(DO) LED56.4(DI)
N$53: LED57.2(DO) LED58.4(DI)
N$54: LED58.2(DO) LED59.4(DI)
N$55: LED59.2(DO) LED60.4(DI)
N$56: LED1.4(DI) PAD1.1(P)
N$57: LED56.2(DO) LED57.4(DI)
N$58: LED61.2(DO) LED62.4(DI)
N$59: LED62.2(DO) LED63.4(DI)
N$60: LED63.2(DO) LED64.4(DI)
N$61: LED64.2(DO) LED65.4(DI)
N$62: LED65.2(DO) LED66.4(DI)
N$63: LED66.2(DO) LED67.4(DI)
N$64: LED67.2(DO) LED68.4(DI)
N$65: LED69.2(DO) LED70.4(DI)
N$66: LED70.2(DO) LED71.4(DI)
N$67: LED71.2(DO) LED72.4(DI)
N$68: LED72.2(DO) LED73.4(DI)
N$69: LED73.2(DO) LED74.4(DI)
N$70: LED74.2(DO) LED75.4(DI)
N$71: LED75.2(DO) LED76.4(DI)
N$72: LED68.2(DO) LED69.4(DI)
N$73: LED77.2(DO) LED78.4(DI)
N$74: LED78.2(DO) LED79.4(DI)
N$75: LED79.2(DO) LED80.4(DI)
N$76: LED80.2(DO) LED81.4(DI)
N$77: LED81.2(DO) LED82.4(DI)
N$78: LED82.2(DO) LED83.4(DI)
N$79: LED83.2(DO) LED84.4(DI)
N$80: LED76.2(DO) LED77.4(DI)
N$81: LED85.2(DO) LED86.4(DI)
N$82: LED86.2(DO) LED87.4(DI)
N$83: LED87.2(DO) LED88.4(DI)
N$84: LED88.2(DO) LED89.4(DI)
N$85: LED89.2(DO) LED90.4(DI)
N$86: LED90.2(DO) LED91.4(DI)
N$87: LED91.2(DO) LED92.4(DI)
N$88: LED84.2(DO) LED85.4(DI)
N$89: LED93.2(DO) LED94.4(DI)
N$90: LED94.2(DO) LED95.4(DI)
N$91: LED95.2(DO) LED96.4(DI)
N$92: LED96.2(DO) LED97.4(DI)
N$93: LED97.2(DO) LED98.4(DI)
N$94: LED98.2(DO) LED99.4(DI)
N$95: LED99.2(DO) LED100.4(DI)
N$96: LED101.2(DO) LED102.4(DI)
N$97: LED102.2(DO) LED103.4(DI)
N$98: LED103.2(DO) LED104.4(DI)
N$99: LED104.2(DO) LED105.4(DI)
N$100: LED105.2(DO) LED106.4(DI)
N$101: LED106.2(DO) LED107.4(DI)
N$102: LED107.2(DO) LED108.4(DI)
N$103: LED100.2(DO) LED101.4(DI)
N$104: LED109.2(DO) LED110.4(DI)
N$105: LED110.2(DO) LED111.4(DI)
N$106: LED111.2(DO) LED112.4(DI)
N$107: LED112.2(DO) LED113.4(DI)
N$108: LED113.2(DO) LED114.4(DI)
N$109: LED114.2(DO) LED115.4(DI)
N$110: LED115.2(DO) LED116.4(DI)
N$111: LED108.2(DO) LED109.4(DI)
N$112: LED117.2(DO) LED118.4(DI)
N$113: LED118.2(DO) LED119.4(DI)
N$114: LED119.2(DO) LED120.4(DI)
N$115: LED120.2(DO) LED121.4(DI)
N$116: LED121.2(DO) LED122.4(DI)
N$117: LED122.2(DO) LED123.4(DI)
N$118: LED123.2(DO) LED124.4(DI)
N$119: LED116.2(DO) LED117.4(DI)
N$120: LED125.2(DO) LED126.4(DI)
N$121: LED126.2(DO) LED127.4(DI)
N$122: LED127.2(DO) LED128.4(DI)
N$123: LED128.2(DO) LED129.4(DI)
N$124: LED129.2(DO) LED130.4(DI)
N$125: LED130.2(DO) LED131.4(DI)
N$126: LED131.2(DO) LED132.4(DI)
N$127: LED124.2(DO) LED125.4(DI)
N$128: LED133.2(DO) LED134.4(DI)
N$129: LED134.2(DO) LED135.4(DI)
N$130: LED135.2(DO) LED136.4(DI)
N$131: LED136.2(DO) LED137.4(DI)
N$132: LED137.2(DO) LED138.4(DI)
N$133: LED138.2(DO) LED139.4(DI)
N$134: LED139.2(DO) LED140.4(DI)
N$135: LED141.2(DO) LED142.4(DI)
N$136: LED142.2(DO) LED143.4(DI)
N$137: LED143.2(DO) LED144.4(DI)
N$138: LED144.2(DO) LED145.4(DI)
N$139: LED145.2(DO) LED146.4(DI)
N$140: LED146.2(DO) LED147.4(DI)
N$141: LED147.2(DO) LED148.4(DI)
N$142: LED140.2(DO) LED141.4(DI)
N$143: LED149.2(DO) LED150.4(DI)
N$144: LED150.2(DO) LED151.4(DI)
N$145: LED151.2(DO) LED152.4(DI)
N$146: LED152.2(DO) LED153.4(DI)
N$147: LED153.2(DO) LED154.4(DI)
N$148: LED154.2(DO) LED155.4(DI)
N$149: LED155.2(DO) LED156.4(DI)
N$150: LED148.2(DO) LED149.4(DI)
N$151: LED157.2(DO) LED158.4(DI)
N$152: LED158.2(DO) LED159.4(DI)
N$153: LED159.2(DO) LED160.4(DI)
N$154: LED160.2(DO) LED161.4(DI)
N$155: LED161.2(DO) LED162.4(DI)
N$156: LED162.2(DO) LED163.4(DI)
N$157: LED163.2(DO) LED164.4(DI)
N$158: LED156.2(DO) LED157.4(DI)
N$159: LED165.2(DO) LED166.4(DI)
N$160: LED166.2(DO) LED167.4(DI)
N$161: LED167.2(DO) LED168.4(DI)
N$162: LED168.2(DO) LED169.4(DI)
N$163: LED169.2(DO) LED170.4(DI)
N$164: LED170.2(DO) LED171.4(DI)
N$165: LED171.2(DO) LED172.4(DI)
N$166: LED164.2(DO) LED165.4(DI)
N$167: LED173.2(DO) LED174.4(DI)
N$168: LED174.2(DO) LED175.4(DI)
N$169: LED175.2(DO) LED176.4(DI)
N$170: LED176.2(DO) LED177.4(DI)
N$171: LED177.2(DO) LED178.4(DI)
N$172: LED178.2(DO) LED179.4(DI)
N$173: LED179.2(DO) LED180.4(DI)
N$174: LED172.2(DO) LED173.4(DI)
N$175: LED181.2(DO) LED182.4(DI)
N$176: LED182.2(DO) LED183.4(DI)
N$177: LED183.2(DO) LED184.4(DI)
N$178: LED184.2(DO) LED185.4(DI)
N$179: LED185.2(DO) LED186.4(DI)
N$180: LED186.2(DO) LED187.4(DI)
N$181: LED187.2(DO) LED188.4(DI)
N$182: LED180.2(DO) LED181.4(DI)
N$183: LED189.2(DO) LED190.4(DI)
N$184: LED190.2(DO) LED191.4(DI)
N$185: LED191.2(DO) LED192.4(DI)
N$186: LED8.2(DO) PAD4.1(P)
N$187: LED49.4(DI) PAD5.1(P)
N$188: LED60.2(DO) PAD8.1(P)
N$189: LED24.2(DO) PAD12.1(P)
N$190: LED188.2(DO) LED189.4(DI)
N$191: LED48.2(DO) PAD16.1(P)
N$192: LED92.2(DO) PAD20.1(P)
N$193: LED192.2(DO) PAD24.1(P)
N$194: LED132.2(DO) PAD28.1(P)
N$195: LED9.4(DI) PAD9.1(P)
N$196: LED25.4(DI) PAD13.1(P)
N$197: LED61.4(DI) PAD17.1(P)
N$198: LED133.4(DI) PAD21.1(P)
N$199: LED93.4(DI) PAD25.1(P)
Unconnected: TP1.TP TP2.TP TP3.TP TP4.TP

## Notes on the sheet
- Released under the Creative Commons Attribution Share-Alike License
- http://creativecommons.org/licenses/by-sa/4.0/
- Designed by Stephan Watterott (Watterott electronic)

## Library data of the parts
C1-C192 = rcl:C-EU: CAPACITOR, European symbol
LED1-LED192 = WS2812:WS2812B
LOGO7 = SparkFun-Aesthetics:OSHW-LOGO: Open Source Hardware Logo This logo indicates the piece of hardware it is found on incorporates a OSHW license and/or adheres to the definition of open source hardware found here: http://freedomdefined.org/OSHW
PAD1-PAD28 = wirepad:SMD2: SMD PAD
TP1-TP4 = testpad:TP: Test pad